# Altium schematic sheet JH-2651M.SchDoc
size 368 x 292 mm
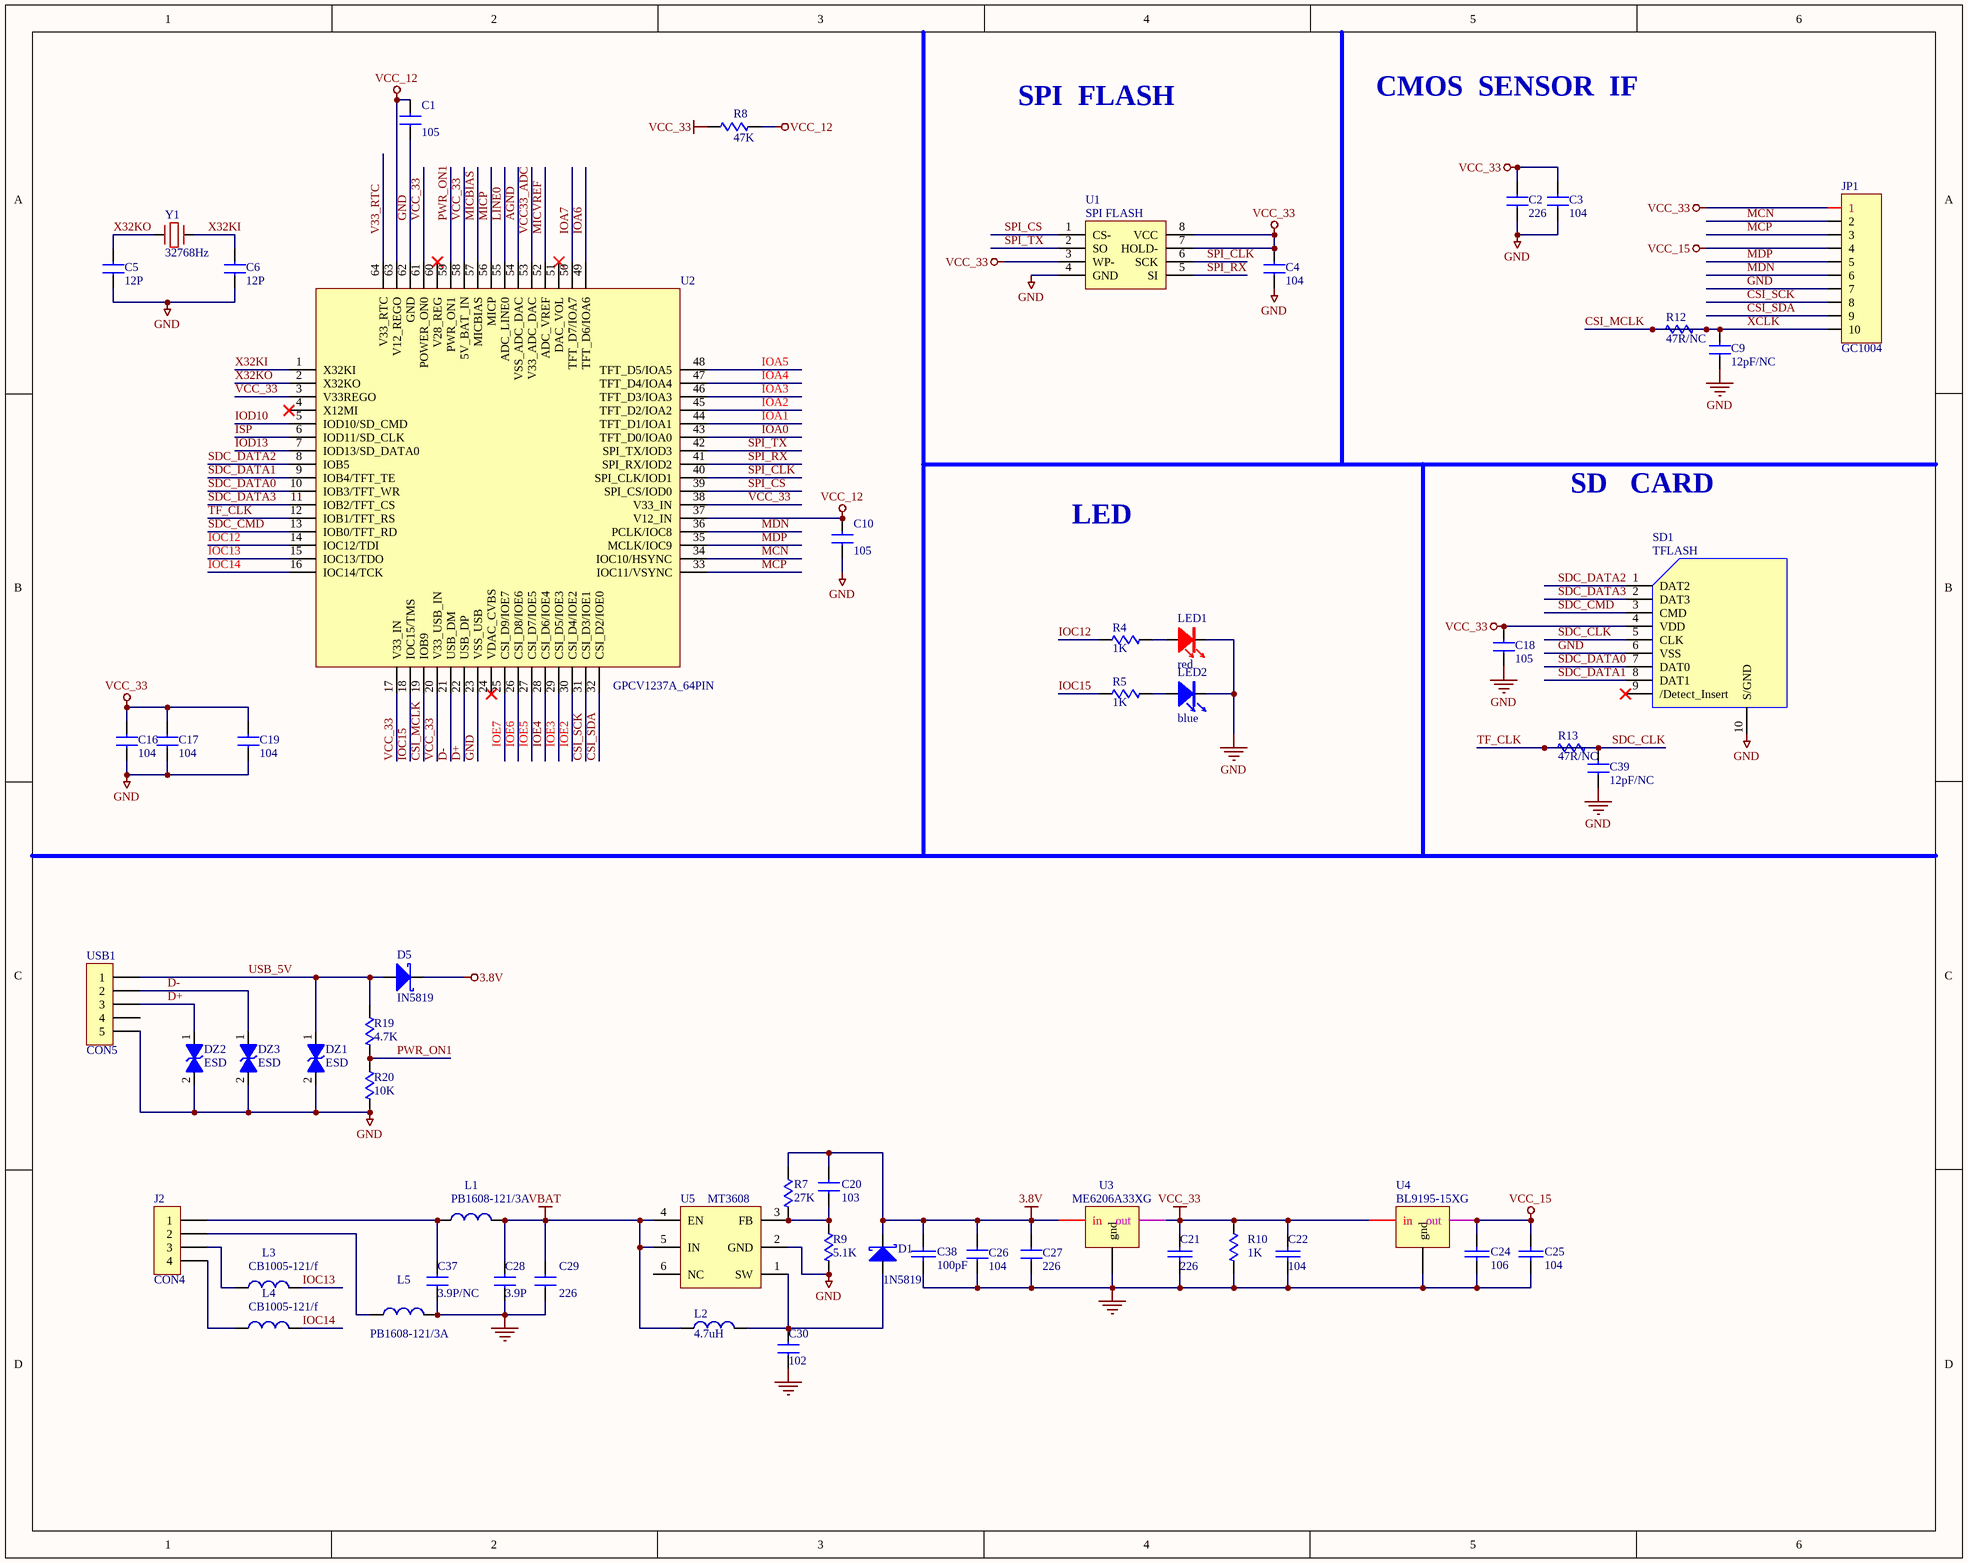
[diagram p0: JH-2651M.SchDoc]

## Parts
C1  105  [C0402]
C2  226  [C0805]
C3  104  [C0402]
C4  104  [C0402]
C5  12P  [C0402]
C6  12P  [C0402]
C9  12pF/NC  [C0402]
C10  105  [C0402]
C16  104  [C0402]
C17  104  [C0402]
C18  105  [C0402]
C19  104  [C0402]
C20  103  [C0402]
C21  226  [C0805]
C22  104  [C0402]
C24  106  [C0603]
C25  104  [C0402]
C26  104  [C0402]
C27  226  [C0805]
C28  3.9P  [C0402]
C29  226  [C0805]
C30  102  [C0402]
C37  3.9P/NC  [C0402]
C38  100pF  [C0402]
C39  12pF/NC  [C0402]
D1  1N5819  [SOD-323]
D5  IN5819  [D0805]
DZ1  ESD  [ESD-SOD323]
DZ2  ESD  [ESD-SOD323]
DZ3  ESD  [ESD-SOD323]
J2  CON4  [SIP4/1.27]
JP1  GC1004  [10pin-mipi/0.7]
L1  PB1608-121/3A  [L0603]
L2  4.7uH  [L3015]
L3  CB1005-121/f  [L0402]
L4  CB1005-121/f  [L0402]
L5  PB1608-121/3A  [L0603]
LED1  red  [LED0603R]
LED2  blue  [LED0603B]
R4  1K  [R0402]
R5  1K  [R0402]
R7  27K  [R0402]
R8  47K  [R0603]
R9  5.1K  [R0402]
R10  1K  [R0402]
R12  47R/NC  [R0402]
R13  47R/NC  [R0402]
R19  4.7K  [R0402]
R20  10K  [R0402]
SD1  TFLASH  [TFC-0002]
U1  SPI FLASH  [SOP8]
U2  GPCV1237A_64PIN  [LQFP64-0.4]
U3  ME6206A33XG  [SOT23]
U4  BL9195-15XG  [SOT23]
U5  MT3608  [SOT23-6]
USB1  CON5
Y1  32768Hz  [XTAL-2X6]

## Nets
3.8V: C20.1 C26.1 C27.1 C38.1 D1.2(K) D5.2(K) R7.1 U3.3(in)
GND: C1.2 C2.2 C3.2 C4.2 C5.2 C6.2 C9.2 C10.2 C16.2 C17.2 C18.2 C19.2 C21.2 C22.2 C24.2 C25.2 C26.2 C27.2 C28.2 C29.2 C30.1 C37.2 C38.2 C39.2 DZ1.2 DZ2.2 DZ3.2 JP1.7 L5.2 LED1.2(K) LED2.2(K) R9.2 R10.2 R20.2 SD1.6(VSS) SD1.10(S/GND) U1.4(GND) U2.23(VSS_USB) U2.62(GND) U3.1(gnd) U4.1(gnd) U5.2(GND) USB1.5
VBAT: C28.1 C29.1 L1.2 L2.1 U5.4(EN) U5.5(IN)
VCC_12: C1.1 C10.1 R8.2 U2.37(V12_IN) U2.63(V12_REGO)
VCC_15: C24.1 C25.1 JP1.4 U4.2(out)
VCC_33: C2.1 C3.1 C4.1 C16.1 C17.1 C18.1 C19.1 C21.1 C22.1 JP1.1 R8.1 R10.1 SD1.4(VDD) U1.3(WP-) U1.7(HOLD-) U1.8(VCC) U2.3(V33REGO) U2.17(V33_IN) U2.20(V33_USB_IN) U2.38(V33_IN) U2.58(5V_BAT_IN) U2.61(POWER_ON0) U3.2(out) U4.3(in)
AGND: U2.54(VSS_ADC_DAC)
CSI_MCLK: C9.1 JP1.10 R12.1 R12.2 U2.19(IOB9)  [also labelled XCLK]
CSI_SCK: JP1.8 U2.31(CSI_D3/IOE1)
CSI_SDA: JP1.9 U2.32(CSI_D2/IOE0)
D+: DZ2.1 U2.22(USB_DP) USB1.3
D-: DZ3.1 U2.21(USB_DM) USB1.2
IOA0: U2.43(TFT_D0/IOA0)
IOA1: U2.44(TFT_D1/IOA1)
IOA2: U2.45(TFT_D2/IOA2)
IOA3: U2.46(TFT_D3/IOA3)
IOA4: U2.47(TFT_D4/IOA4)
IOA5: U2.48(TFT_D5/IOA5)
IOA6: U2.49(TFT_D6/IOA6)
IOA7: U2.50(TFT_D7/IOA7)
IOC12: R4.2 U2.14(IOC12/TDI)
IOC13: L3.2 U2.15(IOC13/TDO)
IOC14: L4.2 U2.16(IOC14/TCK)
IOC15: R5.2 U2.18(IOC15/TMS)
IOD10: U2.5(IOD10/SD_CMD)
IOD13: U2.7(IOD13/SD_DATA0)
IOE2: U2.30(CSI_D4/IOE2)
IOE3: U2.29(CSI_D5/IOE3)
IOE4: U2.28(CSI_D6/IOE4)
IOE5: U2.27(CSI_D7/IOE5)
IOE6: U2.26(CSI_D8/IOE6)
IOE7: U2.25(CSI_D9/IOE7)
ISP: U2.6(IOD11/SD_CLK)
LINE0: U2.55(ADC_LINE0)
MCN: JP1.2 U2.34(IOC10/HSYNC)
MCP: JP1.3 U2.33(IOC11/VSYNC)
MDN: JP1.6 U2.36(PCLK/IOC8)
MDP: JP1.5 U2.35(MCLK/IOC9)
MICBIAS: U2.57(MICBIAS)
MICP: U2.56(MICP)
MICVREF: U2.52(ADC_VREF)
PWR_ON1: R19.2 R20.1 U2.59(PWR_ON1)
SDC_CLK: C39.1 R13.1 R13.2 SD1.5(CLK) U2.12(IOB1/TFT_RS)  [also labelled TF_CLK]
SDC_CMD: SD1.3(CMD) U2.13(IOB0/TFT_RD)
SDC_DATA0: SD1.7(DAT0) U2.10(IOB3/TFT_WR)
SDC_DATA1: SD1.8(DAT1) U2.9(IOB4/TFT_TE)
SDC_DATA2: SD1.1(DAT2) U2.8(IOB5)
SDC_DATA3: SD1.2(DAT3) U2.11(IOB2/TFT_CS)
SPI_CLK: U1.6(SCK) U2.40(SPI_CLK/IOD1)
SPI_CS: U1.1(CS-) U2.39(SPI_CS/IOD0)
SPI_RX: U1.5(SI) U2.41(SPI_RX/IOD2)
SPI_TX: U1.2(SO) U2.42(SPI_TX/IOD3)
USB_5V: D5.1(A) DZ1.1 R19.1 USB1.1
V33_RTC: U2.64(V33_RTC)
VCC33_ADC: U2.53(V33_ADC_DAC)
X32KI: C6.1 U2.1(X32KI) Y1.2
X32KO: C5.1 U2.2(X32KO) Y1.1
NetC20_2: C20.2 R7.2 R9.1 U5.3(FB)
NetC30_2: C30.2 D1.1(A) L2.2 U5.1(SW)
NetC37_1: C37.1 J2.1 L1.1
NetJ2_2: J2.2 L5.1
NetJ2_3: J2.3 L3.1
NetJ2_4: J2.4 L4.1
NetLED1_1: LED1.1(A) R4.1
NetLED2_1: LED2.1(A) R5.1

Not connected (* = marked no-connect by the designer): SD1 9(/Detect_Insert)*; U2 4(X12MI)* 24(VDAC_CVBS)* 51(DAC_VOL)* 60(V28_REG)*; U5 6(NC); USB1 4

## Notes on the sheet
- CMOS  SENSOR  IF
- SPI  FLASH
- SD   CARD
- LED

## Library data of the parts
C1-C6 C9 C10 C16-C20 C26-C30 C37 C39 = CAP: Capacitor; Value: *
C21 C22 C24 C25 C38 = CAP: 贴片电容
D1 D5 = DIODE SCHOTTKY: Diode(Schottky)
J2 = CON4: Connector
JP1 = CON10: Connector; Value: 0.09
L1-L5 = L-1: 电感
LED1 = LED-R: LED/红色
LED2 = LED-B: LED/蓝色
R4 R5 R7-R10 R12 R13 R19 R20 = RES: Resistor
  R4 R5 R8 R10 R12 R13: Value: *
SD1 = SD-MICRO: 外卡卡座
U1 = AT25010A
U2 = GPCV12417A_64PIN
U3 U4 = IC3: IC(Cmanostat)
U5 = Component_1
USB1 = CON5: Connector
Y1 = CRYSTAL: Value: *